# Altium schematic sheet CONNECTORS.SchDoc
size A3; Organization: Electronic Research & Design; Address1: 11 Granofier; Address2: Zwartkop; Address3: Centurion; Address4: South Africa
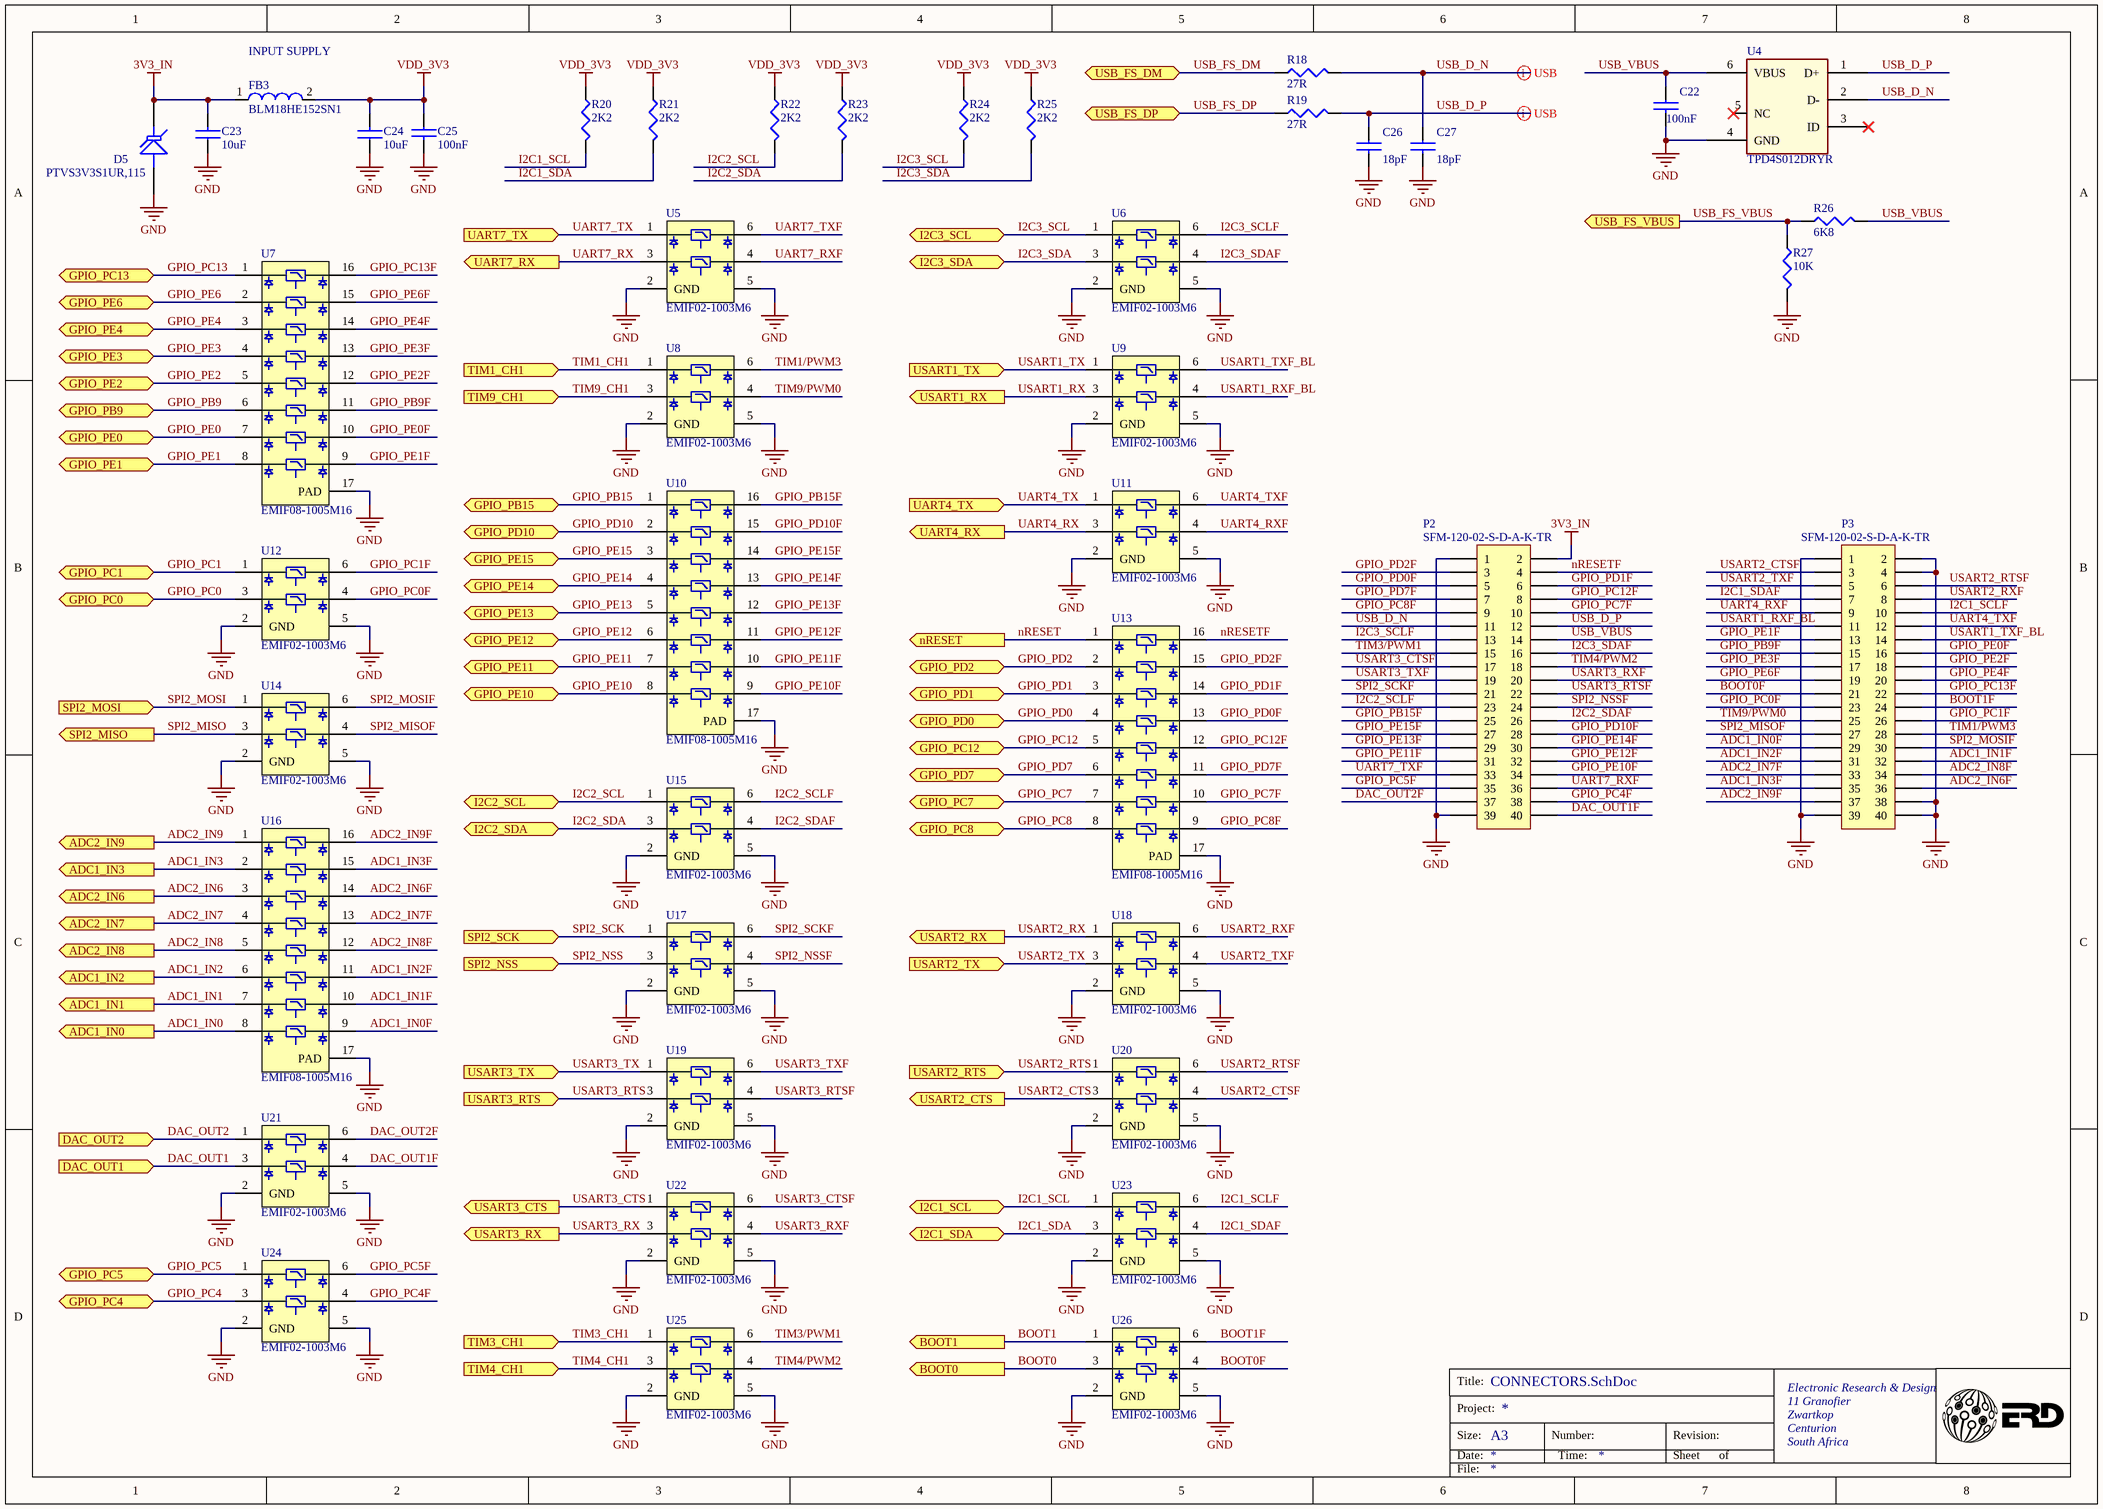
[diagram p0: CONNECTORS.SchDoc]

## Parts
C22  100nF  [CC0402]
C23  10uF  [CC0603]
C24  10uF  [CC0603]
C25  100nF  [CC0402]
C26  18pF  [CC0402]
C27  18pF  [CC0402]
D5  PTVS3V3S1UR,115  [SOD123W]
FB3  BLM18HE152SN1  [LC0603]
P2  SFM-120-02-S-D-A-K-TR  [SFM-120-02-S-D-A-K-TR]
P3  SFM-120-02-S-D-A-K-TR  [SFM-120-02-S-D-A-K-TR]
R18  27R  [RC0402]
R19  27R  [RC0402]
R20  2K2  [RC0402]
R21  2K2  [RC0402]
R22  2K2  [RC0402]
R23  2K2  [RC0402]
R24  2K2  [RC0402]
R25  2K2  [RC0402]
R26  6K8  [RC0402]
R27  10K  [RC0402]
U4  TPD4S012DRYR  [U_6_DRY]
U5  EMIF02-1003M6  [uQFN-6L]
U6  EMIF02-1003M6  [uQFN-6L]
U7  EMIF08-1005M16  [QFN-16L]
U8  EMIF02-1003M6  [uQFN-6L]
U9  EMIF02-1003M6  [uQFN-6L]
U10  EMIF08-1005M16  [QFN-16L]
U11  EMIF02-1003M6  [uQFN-6L]
U12  EMIF02-1003M6  [uQFN-6L]
U13  EMIF08-1005M16  [QFN-16L]
U14  EMIF02-1003M6  [uQFN-6L]
U15  EMIF02-1003M6  [uQFN-6L]
U16  EMIF08-1005M16  [QFN-16L]
U17  EMIF02-1003M6  [uQFN-6L]
U18  EMIF02-1003M6  [uQFN-6L]
U19  EMIF02-1003M6  [uQFN-6L]
U20  EMIF02-1003M6  [uQFN-6L]
U21  EMIF02-1003M6  [uQFN-6L]
U22  EMIF02-1003M6  [uQFN-6L]
U23  EMIF02-1003M6  [uQFN-6L]
U24  EMIF02-1003M6  [uQFN-6L]
U25  EMIF02-1003M6  [uQFN-6L]
U26  EMIF02-1003M6  [uQFN-6L]

## Ports
ADC1_IN0 (out), ADC1_IN1 (out), ADC1_IN2 (out), ADC1_IN3 (out), ADC2_IN6 (out), ADC2_IN7 (out), ADC2_IN8 (out), ADC2_IN9 (out), BOOT0 (out), BOOT1 (out), DAC_OUT1 (in), DAC_OUT2 (in), GPIO_PB9 (bidir), GPIO_PB15 (bidir), GPIO_PC0 (bidir), GPIO_PC1 (bidir), GPIO_PC4 (bidir), GPIO_PC5 (bidir), GPIO_PC7 (bidir), GPIO_PC8 (bidir), GPIO_PC12 (bidir), GPIO_PC13 (bidir), GPIO_PD0 (bidir), GPIO_PD1 (bidir), GPIO_PD2 (bidir), GPIO_PD7 (bidir), GPIO_PD10 (bidir), GPIO_PE0 (bidir), GPIO_PE1 (bidir), GPIO_PE2 (bidir), GPIO_PE3 (bidir), GPIO_PE4 (bidir), GPIO_PE6 (bidir), GPIO_PE10 (bidir), GPIO_PE11 (bidir), GPIO_PE12 (bidir), GPIO_PE13 (bidir), GPIO_PE14 (bidir), GPIO_PE15 (bidir), I2C1_SCL (bidir), I2C1_SDA (bidir), I2C2_SCL (bidir), I2C2_SDA (bidir), I2C3_SCL (bidir), I2C3_SDA (bidir), nRESET (out), SPI2_MISO (out), SPI2_MOSI (in), SPI2_NSS (in), SPI2_SCK (in), TIM1_CH1 (in), TIM3_CH1 (in), TIM4_CH1 (in), TIM9_CH1 (in), UART4_RX (out), UART4_TX (in), UART7_RX (out), UART7_TX (in), USART1_RX (out), USART1_TX (in), USART2_CTS (out), USART2_RTS (in), USART2_RX (out), USART2_TX (in), USART3_CTS (out), USART3_RTS (in), USART3_RX (out), USART3_TX (in), USB_FS_DM (bidir), USB_FS_DP (bidir), USB_FS_VBUS (out)

## Nets
3V3_IN: C23.2 D5.1 FB3.1 P2.2
GND: C22.2 C23.1 C24.1 C25.2 C26.2 C27.2 D5.2 P2.1 P2.39 P3.1 P3.2 P3.4 P3.38 P3.39 P3.40 R27.2 U4.4(GND) U5.2(GND) U5.5(GND) U6.2(GND) U6.5(GND) U7.17(PAD) U8.2(GND) U8.5(GND) U9.2(GND) U9.5(GND) U10.17(PAD) U11.2(GND) U11.5(GND) U12.2(GND) U12.5(GND) U13.17(PAD) U14.2(GND) U14.5(GND) U15.2(GND) U15.5(GND) U16.17(PAD) U17.2(GND) U17.5(GND) U18.2(GND) U18.5(GND) U19.2(GND) U19.5(GND) U20.2(GND) U20.5(GND) U21.2(GND) U21.5(GND) U22.2(GND) U22.5(GND) U23.2(GND) U23.5(GND) U24.2(GND) U24.5(GND) U25.2(GND) U25.5(GND) U26.2(GND) U26.5(GND)
VDD_3V3: C24.2 C25.1 FB3.2 R20.1 R21.1 R22.1 R23.1 R24.1 R25.1
ADC1_IN0: U16.8 ; port ADC1_IN0
ADC1_IN0F: P3.29 U16.9
ADC1_IN1: U16.7 ; port ADC1_IN1
ADC1_IN1F: P3.32 U16.10
ADC1_IN2: U16.6 ; port ADC1_IN2
ADC1_IN2F: P3.31 U16.11
ADC1_IN3: U16.2 ; port ADC1_IN3
ADC1_IN3F: P3.35 U16.15
ADC2_IN6: U16.3 ; port ADC2_IN6
ADC2_IN6F: P3.36 U16.14
ADC2_IN7: U16.4 ; port ADC2_IN7
ADC2_IN7F: P3.33 U16.13
ADC2_IN8: U16.5 ; port ADC2_IN8
ADC2_IN8F: P3.34 U16.12
ADC2_IN9: U16.1 ; port ADC2_IN9
ADC2_IN9F: P3.37 U16.16
BOOT0: U26.3 ; port BOOT0
BOOT0F: P3.21 U26.4
BOOT1: U26.1 ; port BOOT1
BOOT1F: P3.24 U26.6
DAC_OUT1: U21.3 ; port DAC_OUT1
DAC_OUT1F: P2.40 U21.4
DAC_OUT2: U21.1 ; port DAC_OUT2
DAC_OUT2F: P2.37 U21.6
GPIO_PB9: U7.6 ; port GPIO_PB9
GPIO_PB9F: P3.15 U7.11
GPIO_PB15: U10.1 ; port GPIO_PB15
GPIO_PB15F: P2.25 U10.16
GPIO_PC0: U12.3 ; port GPIO_PC0
GPIO_PC0F: P3.23 U12.4
GPIO_PC1: U12.1 ; port GPIO_PC1
GPIO_PC1F: P3.26 U12.6
GPIO_PC4: U24.3 ; port GPIO_PC4
GPIO_PC4F: P2.38 U24.4
GPIO_PC5: U24.1 ; port GPIO_PC5
GPIO_PC5F: P2.35 U24.6
GPIO_PC7: U13.7 ; port GPIO_PC7
GPIO_PC7F: P2.10 U13.10
GPIO_PC8: U13.8 ; port GPIO_PC8
GPIO_PC8F: P2.9 U13.9
GPIO_PC12: U13.5 ; port GPIO_PC12
GPIO_PC12F: P2.8 U13.12
GPIO_PC13: U7.1 ; port GPIO_PC13
GPIO_PC13F: P3.22 U7.16
GPIO_PD0: U13.4 ; port GPIO_PD0
GPIO_PD0F: P2.5 U13.13
GPIO_PD1: U13.3 ; port GPIO_PD1
GPIO_PD1F: P2.6 U13.14
GPIO_PD2: U13.2 ; port GPIO_PD2
GPIO_PD2F: P2.3 U13.15
GPIO_PD7: U13.6 ; port GPIO_PD7
GPIO_PD7F: P2.7 U13.11
GPIO_PD10: U10.2 ; port GPIO_PD10
GPIO_PD10F: P2.28 U10.15
GPIO_PE0: U7.7 ; port GPIO_PE0
GPIO_PE0F: P3.16 U7.10
GPIO_PE1: U7.8 ; port GPIO_PE1
GPIO_PE1F: P3.13 U7.9
GPIO_PE2: U7.5 ; port GPIO_PE2
GPIO_PE2F: P3.18 U7.12
GPIO_PE3: U7.4 ; port GPIO_PE3
GPIO_PE3F: P3.17 U7.13
GPIO_PE4: U7.3 ; port GPIO_PE4
GPIO_PE4F: P3.20 U7.14
GPIO_PE6: U7.2 ; port GPIO_PE6
GPIO_PE6F: P3.19 U7.15
GPIO_PE10: U10.8 ; port GPIO_PE10
GPIO_PE10F: P2.34 U10.9
GPIO_PE11: U10.7 ; port GPIO_PE11
GPIO_PE11F: P2.31 U10.10
GPIO_PE12: U10.6 ; port GPIO_PE12
GPIO_PE12F: P2.32 U10.11
GPIO_PE13: U10.5 ; port GPIO_PE13
GPIO_PE13F: P2.29 U10.12
GPIO_PE14: U10.4 ; port GPIO_PE14
GPIO_PE14F: P2.30 U10.13
GPIO_PE15: U10.3 ; port GPIO_PE15
GPIO_PE15F: P2.27 U10.14
I2C1_SCL: R20.2 U23.1 ; port I2C1_SCL
I2C1_SCLF: P3.10 U23.6
I2C1_SDA: R21.2 U23.3 ; port I2C1_SDA
I2C1_SDAF: P3.7 U23.4
I2C2_SCL: R22.2 U15.1 ; port I2C2_SCL
I2C2_SCLF: P2.23 U15.6
I2C2_SDA: R23.2 U15.3 ; port I2C2_SDA
I2C2_SDAF: P2.26 U15.4
I2C3_SCL: R24.2 U6.1 ; port I2C3_SCL
I2C3_SCLF: P2.13 U6.6
I2C3_SDA: R25.2 U6.3 ; port I2C3_SDA
I2C3_SDAF: P2.16 U6.4
nRESET: U13.1 ; port nRESET
nRESETF: P2.4 U13.16
SPI2_MISO: U14.3 ; port SPI2_MISO
SPI2_MISOF: P3.27 U14.4
SPI2_MOSI: U14.1 ; port SPI2_MOSI
SPI2_MOSIF: P3.30 U14.6
SPI2_NSS: U17.3 ; port SPI2_NSS
SPI2_NSSF: P2.24 U17.4
SPI2_SCK: U17.1 ; port SPI2_SCK
SPI2_SCKF: P2.21 U17.6
TIM1/PWM3: P3.28 U8.6
TIM1_CH1: U8.1 ; port TIM1_CH1
TIM3/PWM1: P2.15 U25.6
TIM3_CH1: U25.1 ; port TIM3_CH1
TIM4/PWM2: P2.18 U25.4
TIM4_CH1: U25.3 ; port TIM4_CH1
TIM9/PWM0: P3.25 U8.4
TIM9_CH1: U8.3 ; port TIM9_CH1
UART4_RX: U11.3 ; port UART4_RX
UART4_RXF: P3.9 U11.4
UART4_TX: U11.1 ; port UART4_TX
UART4_TXF: P3.12 U11.6
UART7_RX: U5.3 ; port UART7_RX
UART7_RXF: P2.36 U5.4
UART7_TX: U5.1 ; port UART7_TX
UART7_TXF: P2.33 U5.6
USART1_RX: U9.3 ; port USART1_RX
USART1_RXF_BL: P3.11 U9.4
USART1_TX: U9.1 ; port USART1_TX
USART1_TXF_BL: P3.14 U9.6
USART2_CTS: U20.3 ; port USART2_CTS
USART2_CTSF: P3.3 U20.4
USART2_RTS: U20.1 ; port USART2_RTS
USART2_RTSF: P3.6 U20.6
USART2_RX: U18.1 ; port USART2_RX
USART2_RXF: P3.8 U18.6
USART2_TX: U18.3 ; port USART2_TX
USART2_TXF: P3.5 U18.4
USART3_CTS: U22.1 ; port USART3_CTS
USART3_CTSF: P2.17 U22.6
USART3_RTS: U19.3 ; port USART3_RTS
USART3_RTSF: P2.22 U19.4
USART3_RX: U22.3 ; port USART3_RX
USART3_RXF: P2.20 U22.4
USART3_TX: U19.1 ; port USART3_TX
USART3_TXF: P2.19 U19.6
USB_D_N: C27.1 P2.11 R18.2 U4.2(D-)
USB_D_P: C26.1 P2.12 R19.2 U4.1(D+)
USB_FS_DM: R18.1 ; port USB_FS_DM
USB_FS_DP: R19.1 ; port USB_FS_DP
USB_FS_VBUS: R26.1 R27.1 ; port USB_FS_VBUS
USB_VBUS: C22.1 P2.14 R26.2 U4.6(VBUS)

Not connected (* = marked no-connect by the designer): U4 3(ID)* 5(NC)*

## Layout directives
differential pair: USB_D_N, USB_D_P

## Notes on the sheet
- (near FB3) INPUT SUPPLY
- Title:
- Size:
- Date:
- Project:
- A3
- Number:
- Time:
- Revision:
- Sheet
- of
- File:

## Library data of the parts
C22 C25 = CAP CER 0.1UF 10V 10% X5R 0402: CAP CER 0.1UF 50V 10% X7R 0402; Manufacturer: Murata; PartNumber: GCM155R71H104KE02D; Package / Case: 0402 (1005 Metric); Supplier: AAD
C23 C24 = CAP CER 0.1UF 10V 10% X5R 0402: CAP CER 10UF 25V 20% X5R 0603; Manufacturer: Murata; PartNumber: GRM188R61E106MA73D; Package / Case: 0603; Supplier: AAD
C26 C27 = CAP CER 2.2UF 6.3V 10% X5R 0402: CAP CER 18pF 50V 5% C0G 0402; Manufacturer: AVX; PartNumber: GJM1555C1H180FB01D; Package / Case: 0402 (1005 Metric); Supplier: AAD; Supplier Stock Code: N/A
D5 = Tranzorb: TVS, 3V3; PartNumber: PTVS3V3S1UR,115
FB3 = FER_180_200_0: FERRITE, 500mA, 500mOHM, 0603; PartNumber: BLM18HE152SN1
P2 P3 = Header 20X2: Receptacle, 40 POS, 1.27mm PITCH, SMD; PartNumber: SFM-120-02-S-D-A-K-TR
R18 R19 = RES_10K_1/16W_1%_0402: RES, 27 OHM, 1/16W, 1%, 0402; Manufacturer: Yageo; PartNumber: RC0402FR-0727RL; Package / Case: 0402 (1005 Metric); Supplier: AAD
R20-R25 = RES_10K_1/16W_1%_0402: RES, 2K2 OHM, 1/16W, 1%, 0402; Manufacturer: Yageo; PartNumber: RC0402FR-072K2L; Package / Case: 0402 (1005 Metric); Supplier: AAD
R26 = RES_10K_1/16W_1%_0402: RES, 6K8 OHM, 1/16W, 1%, 0402; Manufacturer: Yageo; PartNumber: RC0402FR-076K8L; Package / Case: 0402 (1005 Metric); Supplier: AAD
R27 = RES_10K_1/16W_1%_0402: RES, 10K OHM, 1/16W, 1%, 0402; Manufacturer: Yageo; PartNumber: RC0402FR-0710KL; Package / Case: 0402 (1005 Metric); Supplier: AAD
U4 = PROT_TPD4S012: ESD 4channel USB Interface; Manufacturer: Texas Instruments; PartNumber: TPD4S012DRYR; Package / Case: 6-UFDFN; Supplier: AAD; Supplier Stock Code: N/A
U5 U6 U8 U9 U11 U12 U14 U15 U17-U26 = EMIF02-1003M6: EMI Filter, ESD, uQFN-6; PartNumber: EMIF02-1003M6
U7 U10 U13 U16 = EMIF08-1005M16: EMI Filter, ESD, QFN-16L; PartNumber: EMIF08-1005M16